# Altium schematic sheet ProjectInfo.SchDoc
size A4; Organization: Medical Technologies CZ a.s.; DocumentNumber: ?; SheetNumber: ?; SheetTotal: 1; Version1: N/A; Version2: N/A; Version3: N/A; Change1description: N/A; Change2description: N/A; Change3description: N/A; Change1DrawnBy: N/A; Change2DrawnBy: N/A; Change3DrawnBy: N/A; Change1CheckedBy: N/A; Change2CheckedBy: N/A; Change3CheckedBy: N/A; PreviusVersion_Chng1: N/A; PreviusVersion_Chng2: N/A; PreviusVersion_Chng3: N/A; Variant1description: Standard assembly; Variant2description: N/A; Variant3description: N/A; Variant4description: N/A; PrimaryCard1: XXXxxxXXX; PrimaryCard2: N/A; PrimaryCard3: N/A; PrimaryCard4: N/A; DocumentName: Docname
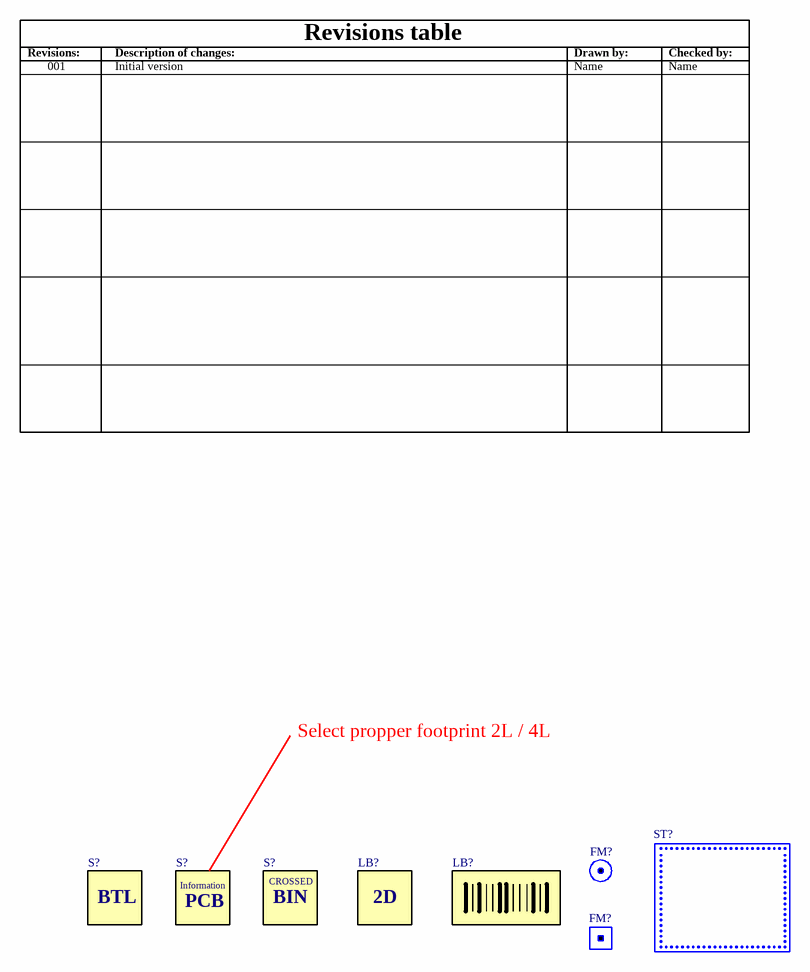
[diagram p0: ProjectInfo.SchDoc]

## Parts
(Parts that share a designator on the sheet are numbered #1, #2 ... from top to bottom, then left to right.)
FM?#1  Fiducial Mark Circle  [FM_CIRCLE_BTL]  (value not drawn)
FM?#2  Fiducial Mark Square  [FM_SQUARE_BTL]  (value not drawn)
LB?#1  LABEL_MATRIX_CODE  [MATRIX_CODE]  (value not drawn)  (no BOM)
LB?#2  LABEL_BAR_CODE  [BAR_CODE]  (value not drawn)  (no BOM)
S?#1  SYMBOL_LOGO_BTL  [BTL_LOGO_3MM]  (value not drawn)  (no BOM)
S?#2  SYMBOL_PCB_INFO_TABLE  [PCB_INFO_2L]  (value not drawn)  (no BOM)
S?#3  SYMBOL_CROSSED_BIN  [CROSSED_BIN]  (value not drawn)  (no BOM)
ST?  PASTE_STENCIL  [PASTE_STENCIL]  (value not drawn)  (no BOM)

## Notes on the sheet
- Revisions:
- 001
- Description of changes:
- Initial version
- Revisions table
- Drawn by:
- Name
- Checked by:
- Select propper footprint 2L / 4L
- Číslo výkresu /drawing number/:
- Nazev listu/sheet name/:
- DPS projekt/PCB project/:
- Kreslil /drawn by/ :
- Kontroloval /checked by/:
- Schvalil /approved by/:
- Podpis /signature/:
- Datum /date/:
- List /sheet/:
- /
- (in symbol 000-SPACE2D100) 2D
- (in symbol 000-SYMBIN100) CROSSED; BIN
- (in symbol 000-SYMBTL100) BTL
- (in symbol 000-TABPCB100) Information; PCB

## Library data of the parts
FM?#1 = 000+FMC100: De; Fiducial Mark;; Component_Class: Design Entity; Status_I: Development; Status_II: Testing; KK: 000+FMC100; Value: Fiducial Mark Circle; SMD: 1; Entity_Type: Fiducial Mark; ComponentLink1URL: heliosgreen://v1/hegMT/5-MT/Classes(343)/Folders/OpenForm?RecordNumbers=[12022158]; ComponentLink1Description: Helios
FM?#2 = 000+FMS100: De; Fiducial Mark;; Component_Class: Design Entity; Status_I: Development; Status_II: Testing; KK: 000+FMS100; Value: Fiducial Mark Square; SMD: 1; Entity_Type: Fiducial Mark; ComponentLink1URL: heliosgreen://v1/hegMT/5-MT/Classes(343)/Folders/OpenForm?RecordNumbers=[12022164]; ComponentLink1Description: Helios
LB?#1 = 000-SPACE2D100: De; Space for...;; Note: Space for 2D code sticker; Component_Class: Design Entity; Status_I: Development; Status_II: Testing; KK: 000-SPACE2D100; Value: LABEL_MATRIX_CODE; SMD: 0; Entity_Type: Space for...; ComponentLink1URL: heliosgreen://v1/hegMT/5-MT/Classes(343)/Folders/OpenForm?RecordNumbers=[12022194]; ComponentLink1Description: Helios
LB?#2 = 000-SPACEFB100: De; Space for...;; Component_Class: Design Entity; Status_I: Development; Status_II: Testing; KK: 000-SPACEFB100; Value: LABEL_BAR_CODE; SMD: 0; Entity_Type: Space for...; ComponentLink1URL: heliosgreen://v1/hegMT/5-MT/Classes(343)/Folders/OpenForm?RecordNumbers=[12022182]; ComponentLink1Description: Helios
S?#1 = 000-SYMBTL100: De; Symbols/Tables;; Note: Symbol BTL logos for silkscreen or Copper; Component_Class: Design Entity; Status_I: Development; Status_II: Testing; KK: 000-SYMBTL100; Value: SYMBOL_LOGO_BTL; SMD: 0; Entity_Type: Symbols/Tables; ComponentLink1URL: heliosgreen://v1/hegMT/5-MT/Classes(343)/Folders/OpenForm?RecordNumbers=[12022368]; ComponentLink1Description: Helios
S?#2 = 000-TABPCB100: De; Symbols/Tables;; Note: Table of PCB Informations, for 2L or 4L PCB.; Component_Class: Design Entity; Status_I: Development; Status_II: Testing; KK: 000-TABPCB100; Value: SYMBOL_PCB_INFO_TABLE; SMD: 0; Entity_Type: Symbols/Tables; ComponentLink1URL: heliosgreen://v1/hegMT/5-MT/Classes(343)/Folders/OpenForm?RecordNumbers=[12022380]; ComponentLink1Description: Helios
S?#3 = 000-SYMBIN100: De; Symbols/Tables;; Note: Symbol Crossed Bin; Component_Class: Design Entity; Status_I: Development; Status_II: Testing; KK: 000-SYMBIN100; Value: SYMBOL_CROSSED_BIN; SMD: 0; Entity_Type: Symbols/Tables; ComponentLink1URL: heliosgreen://v1/hegMT/5-MT/Classes(343)/Folders/OpenForm?RecordNumbers=[12022356]; ComponentLink1Description: Helios
ST? = 000-STENCIL100: De; Other;; Note: Solder Paste Stencil;; Component_Class: Design Entity; Status_I: Development; Status_II: Testing; KK: 000-STENCIL100; Value: PASTE_STENCIL; SMD: 0; Entity_Type: Other; ComponentLink1URL: heliosgreen://v1/hegMT/5-MT/Classes(343)/Folders/OpenForm?RecordNumbers=[12022350]; ComponentLink1Description: Helios